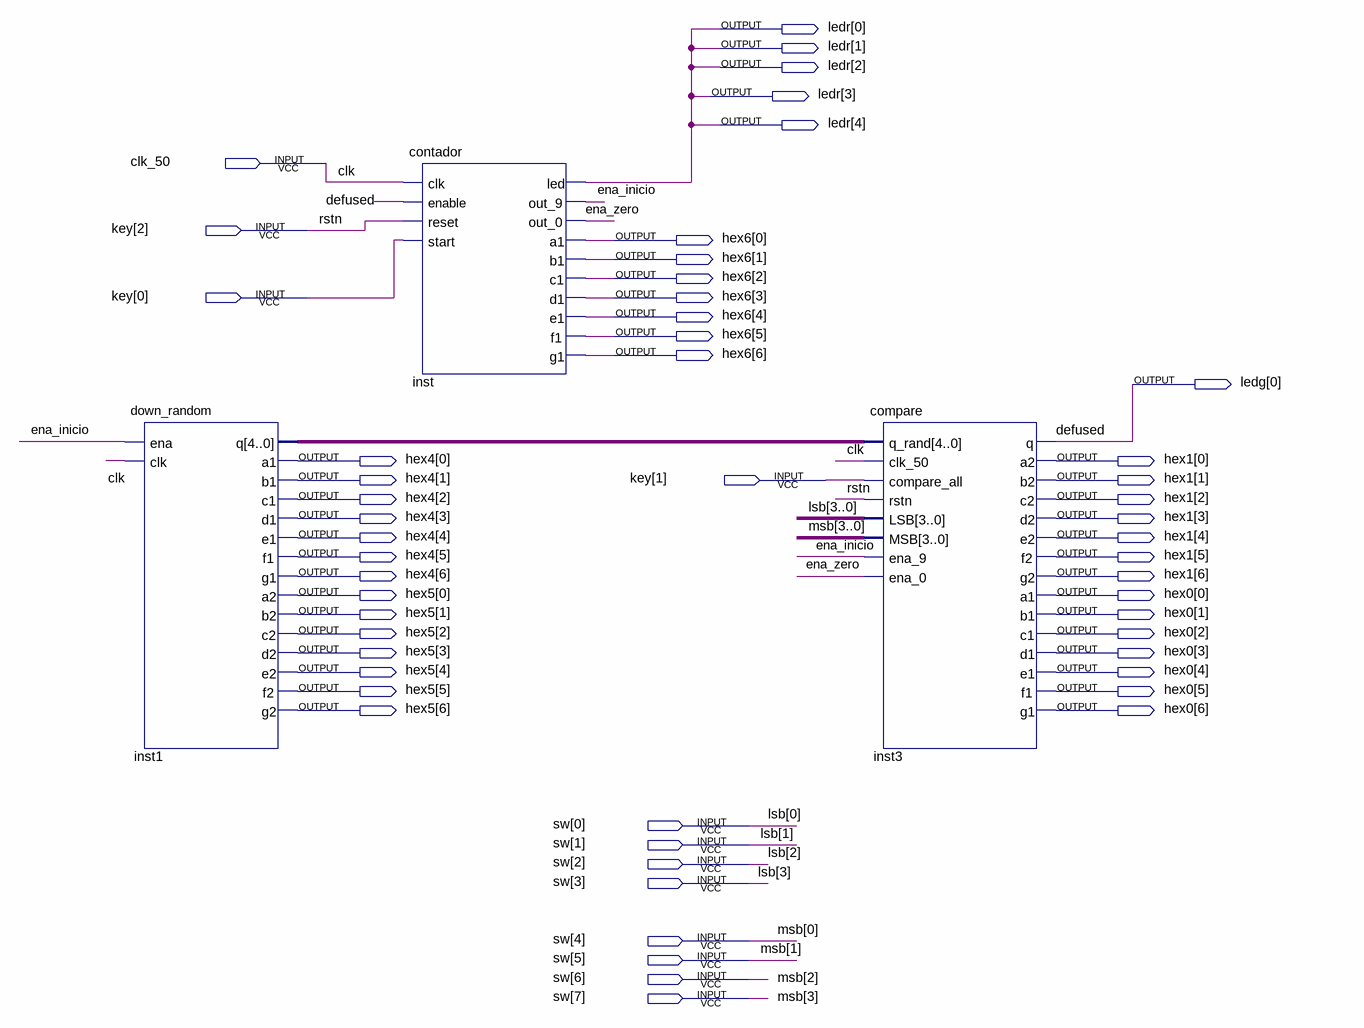
[diagram p0: schematic sheet]
// Quartus schematic teste.bdf as structural Verilog: 3 symbols, 53 pins
module teste (
  input  clk_50,
  input  [2:0] key,
  input  [7:0] sw,
  output [4:0] ledr,
  output [6:0] hex6,
  output [0:0] ledg,
  output [6:0] hex4,
  output [6:0] hex1,
  output [6:0] hex5,
  output [6:0] hex0
);

  wire ena_inicio, ena_zero;
  wire [4:0] inst1_q;

  down_random inst1 (
    .ena(ena_inicio), .clk(clk_50), .q(inst1_q), .a1(hex4[0]), .b1(hex4[1]), .c1(hex4[2]), .d1(hex4[3]),
    .e1(hex4[4]), .f1(hex4[5]), .g1(hex4[6]), .a2(hex5[0]), .b2(hex5[1]), .c2(hex5[2]), .d2(hex5[3]),
    .e2(hex5[4]), .f2(hex5[5]), .g2(hex5[6]));
  contador inst (
    .clk(clk_50), .enable(ledg[0]), .reset(key[2]), .start(key[0]), .led(ledr[4]), .out_9(ena_inicio),
    .out_0(ena_zero), .a1(hex6[0]), .b1(hex6[1]), .c1(hex6[2]), .d1(hex6[3]), .e1(hex6[4]), .f1(hex6[5]),
    .g1(hex6[6]));
  compare inst3 (
    .q_rand(inst1_q), .clk_50(clk_50), .compare_all(key[1]), .rstn(key[2]), .LSB(sw[3:0]), .MSB(sw[7:4]),
    .ena_9(ena_inicio), .ena_0(ena_zero), .q(ledg[0]), .a2(hex1[0]), .b2(hex1[1]), .c2(hex1[2]),
    .d2(hex1[3]), .e2(hex1[4]), .f2(hex1[5]), .g2(hex1[6]), .a1(hex0[0]), .b1(hex0[1]), .c1(hex0[2]),
    .d1(hex0[3]), .e1(hex0[4]), .f1(hex0[5]), .g1(hex0[6]));

  assign ledr[3:0] = {4{ledr[4]}};

  // Other names for the same wires on the sheet: clk = clk_50; defused = ledg[0]; lsb[3:0] = sw[3:0];
  //   msb[3:0] = sw[7:4]; rstn = key[2]
endmodule
